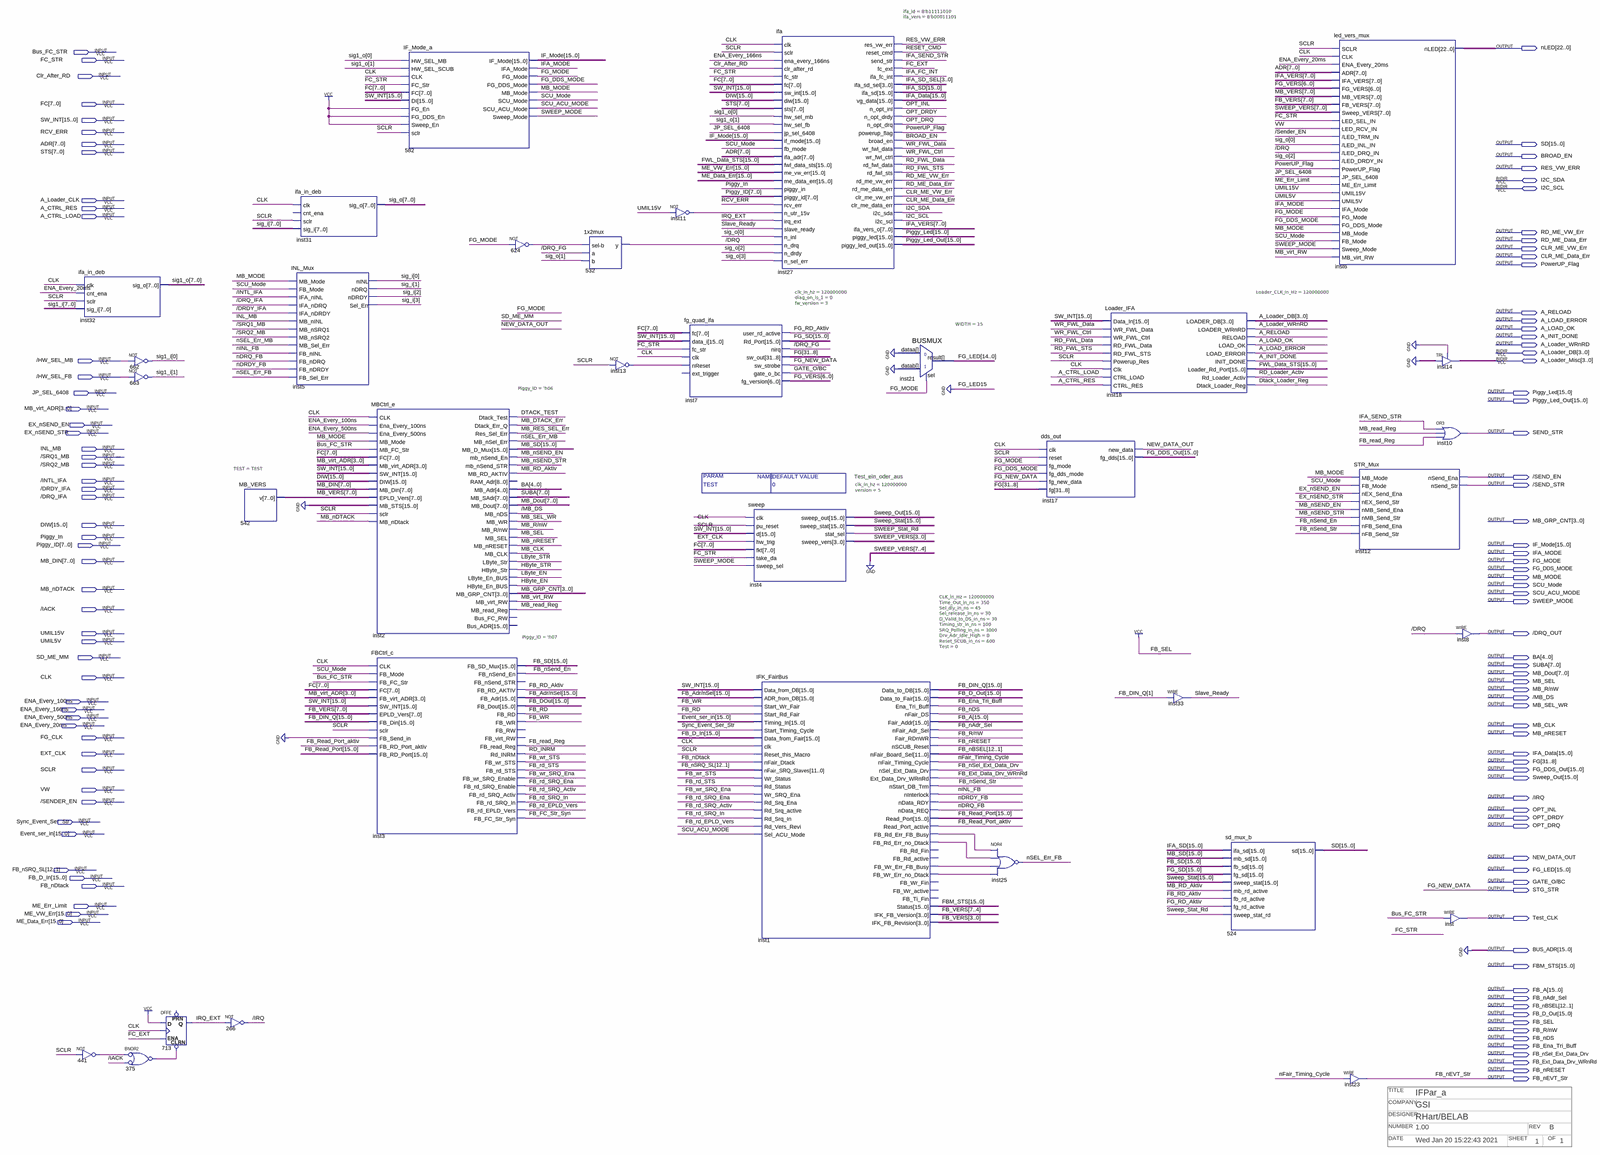
[diagram p0: schematic sheet, whole]
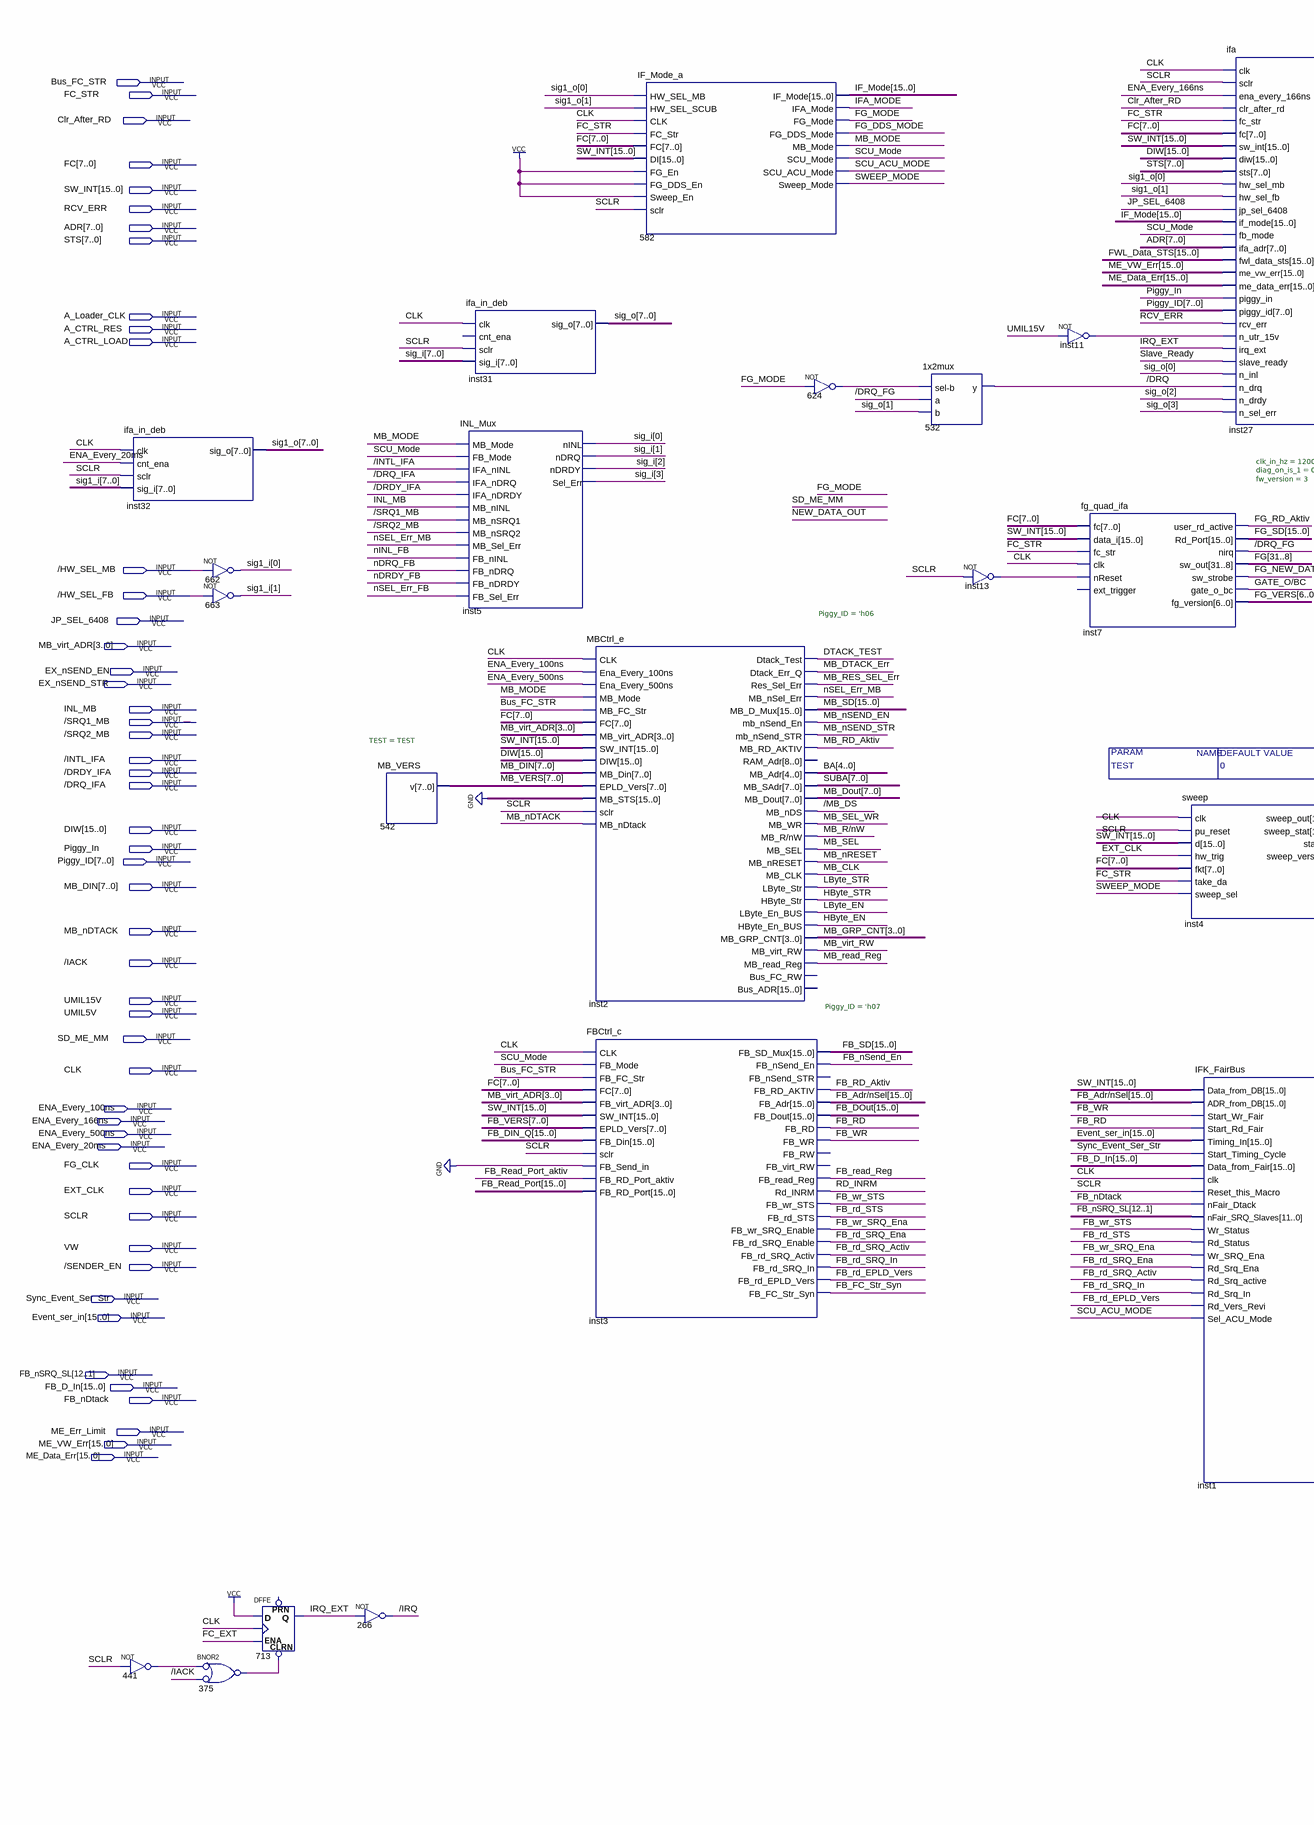
[diagram p1: schematic sheet, left part]
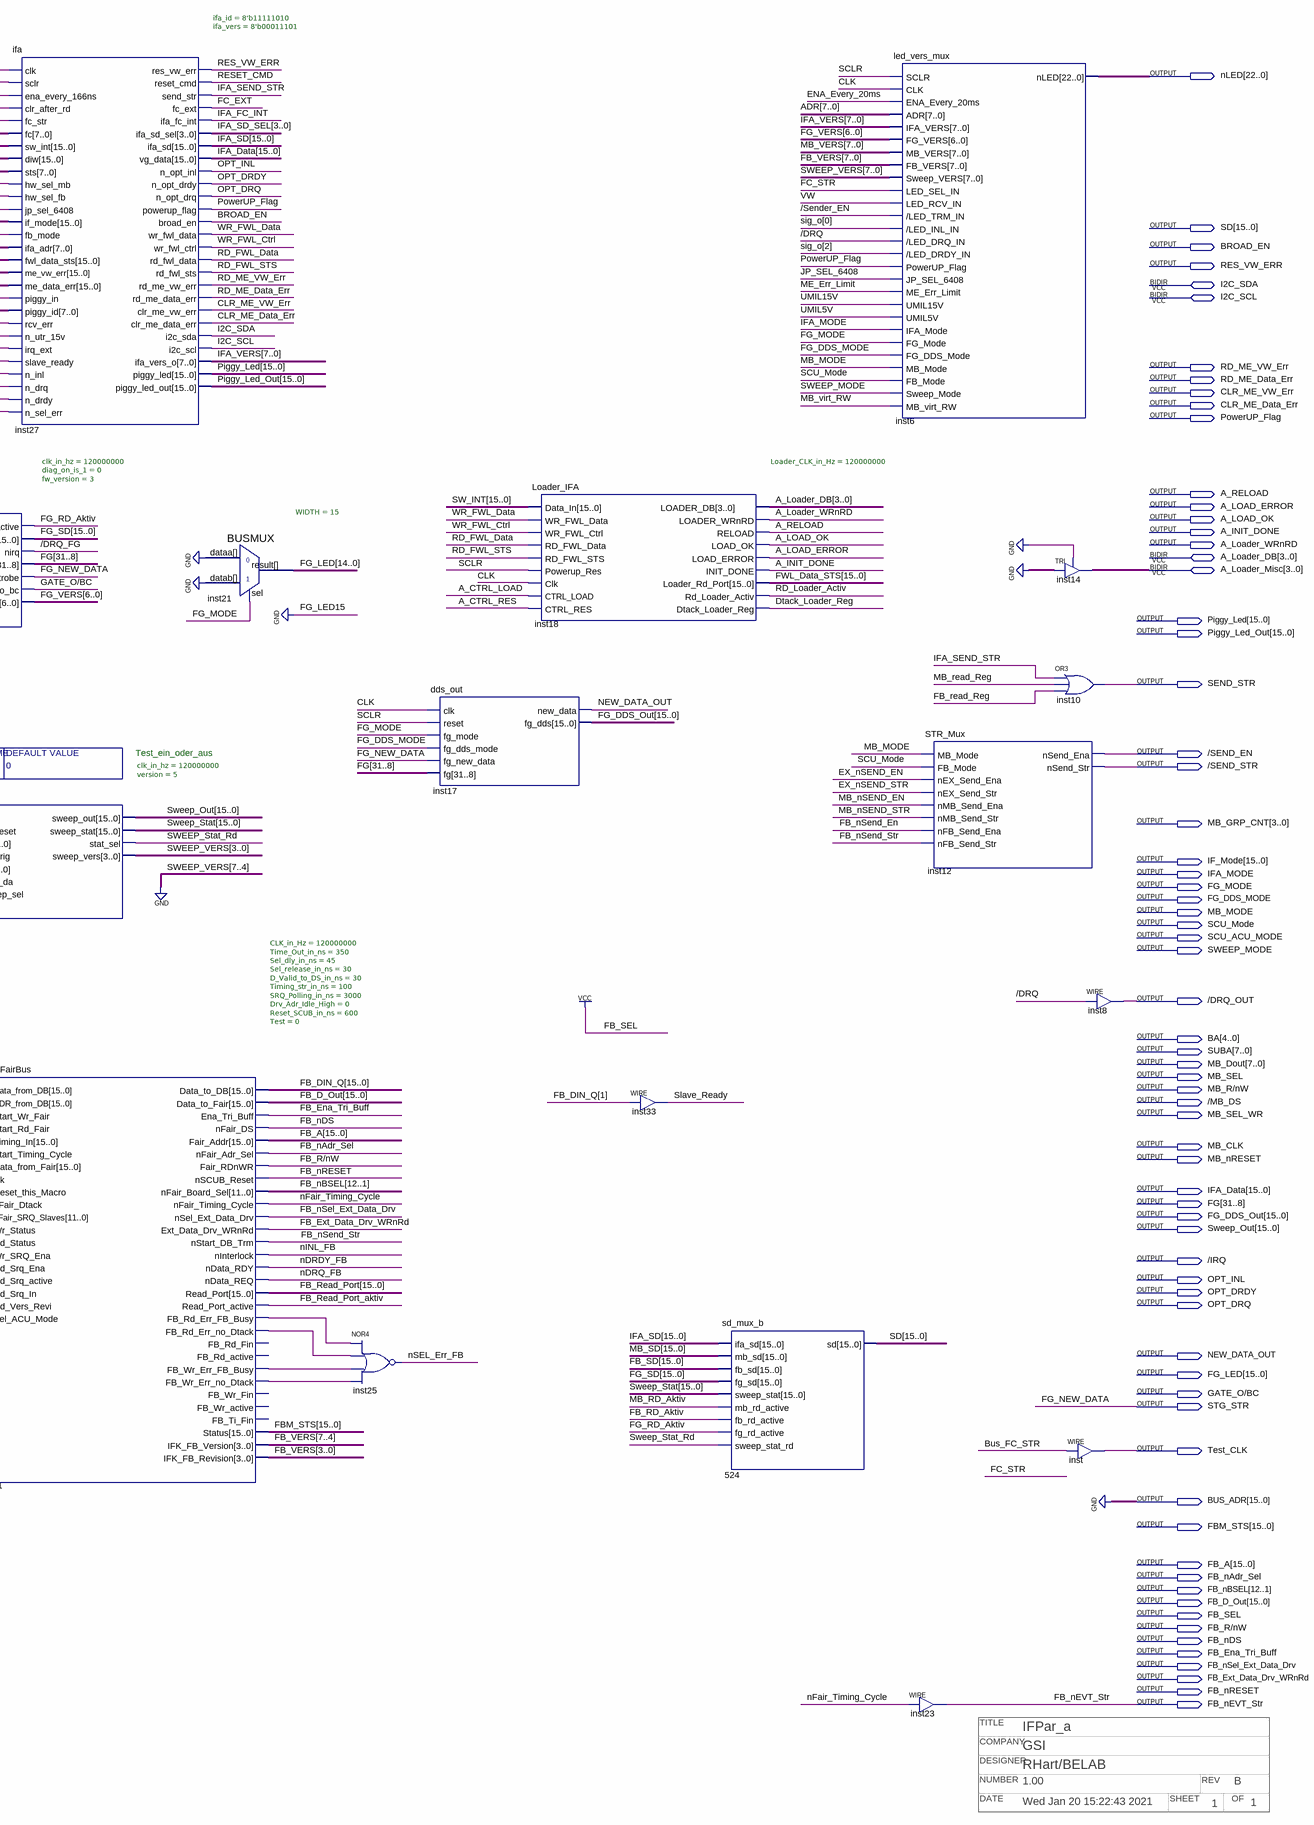
[diagram p2: schematic sheet, right part]
// Quartus schematic ifpar_a.bdf as structural Verilog: 34 symbols, 119 pins
// Title block: TITLE: IFPar_a; COMPANY: GSI; DESIGNER: RHart/BELAB; NUMBER: 1.00; REV: B; DATE: Wed Jan 20 15:22:43 2021; SHEET: 1; OF: 1
module ifpar_a #(parameter TEST = 0) (
  input  Bus_FC_STR,
  input  FC_STR,
  input  Clr_After_RD,
  input  [7:0] FC,
  input  [15:0] SW_INT,
  input  RCV_ERR,
  input  [7:0] ADR,
  input  [7:0] STS,
  input  A_Loader_CLK,
  input  A_CTRL_RES,
  input  A_CTRL_LOAD,
  input  \/HW_SEL_MB ,
  input  \/HW_SEL_FB ,
  input  JP_SEL_6408,
  input  [3:0] MB_virt_ADR,
  input  EX_nSEND_EN,
  input  EX_nSEND_STR,
  input  INL_MB,
  input  \/SRQ1_MB ,
  input  \/SRQ2_MB ,
  input  \/INTL_IFA ,
  input  \/DRDY_IFA ,
  input  \/DRQ_IFA ,
  input  [15:0] DIW,
  input  Piggy_In,
  input  [7:0] Piggy_ID,
  input  [7:0] MB_DIN,
  input  MB_nDTACK,
  input  \/IACK ,
  input  UMIL15V,
  input  UMIL5V,
  input  SD_ME_MM,
  input  CLK,
  input  ENA_Every_100ns,
  input  ENA_Every_166ns,
  input  ENA_Every_500ns,
  input  ENA_Every_20ms,
  input  FG_CLK,
  input  EXT_CLK,
  input  SCLR,
  input  VW,
  input  \/SENDER_EN ,
  input  Sync_Event_Ser_Str,
  input  [15:0] Event_ser_in,
  input  [12:1] FB_nSRQ_SL,
  input  [15:0] FB_D_In,
  input  FB_nDtack,
  input  ME_Err_Limit,
  input  [15:0] ME_VW_Err,
  input  [15:0] ME_Data_Err,
  inout  I2C_SDA,
  inout  I2C_SCL,
  inout  [3:0] A_Loader_DB,
  inout  [3:0] A_Loader_Misc,
  output [22:0] nLED,
  output [15:0] SD,
  output BROAD_EN,
  output RES_VW_ERR,
  output RD_ME_VW_Err,
  output RD_ME_Data_Err,
  output CLR_ME_VW_Err,
  output CLR_ME_Data_Err,
  output PowerUP_Flag,
  output A_RELOAD,
  output A_LOAD_ERROR,
  output A_LOAD_OK,
  output A_INIT_DONE,
  output A_Loader_WRnRD,
  output [15:0] Piggy_Led,
  output [15:0] Piggy_Led_Out,
  output SEND_STR,
  output \/SEND_EN ,
  output \/SEND_STR ,
  output [3:0] MB_GRP_CNT,
  output [15:0] IF_Mode,
  output IFA_MODE,
  output FG_MODE,
  output FG_DDS_MODE,
  output MB_MODE,
  output SCU_Mode,
  output SCU_ACU_MODE,
  output SWEEP_MODE,
  output \/DRQ_OUT ,
  output [4:0] BA,
  output [7:0] SUBA,
  output [7:0] MB_Dout,
  output MB_SEL,
  output \MB_R/nW ,
  output \/MB_DS ,
  output MB_SEL_WR,
  output MB_CLK,
  output MB_nRESET,
  output [15:0] IFA_Data,
  output [31:8] FG,
  output [15:0] FG_DDS_Out,
  output [15:0] Sweep_Out,
  output \/IRQ ,
  output OPT_INL,
  output OPT_DRDY,
  output OPT_DRQ,
  output NEW_DATA_OUT,
  output [15:0] FG_LED,
  output \GATE_O/BC ,
  output STG_STR,
  output Test_CLK,
  output [15:0] BUS_ADR,
  output [15:0] FBM_STS,
  output [15:0] FB_A,
  output FB_nAdr_Sel,
  output [12:1] FB_nBSEL,
  output [15:0] FB_D_Out,
  output FB_SEL,
  output \FB_R/nW ,
  output FB_nDS,
  output FB_Ena_Tri_Buff,
  output FB_nSel_Ext_Data_Drv,
  output FB_Ext_Data_Drv_WRnRd,
  output FB_nRESET,
  output FB_nEVT_Str
);

  wire \/DRQ , \/DRQ_FG , Dtack_Loader_Reg, DTACK_TEST, FB_FC_Str_Syn, FB_nSend_En, FB_nSend_Str, FB_RD,
       FB_RD_Aktiv, FB_rd_EPLD_Vers, FB_rd_SRQ_Activ, FB_rd_SRQ_Ena, FB_rd_SRQ_In, FB_rd_STS,
       FB_Read_Port_aktiv, FB_read_Reg, FB_WR, FB_wr_SRQ_Ena, FB_wr_STS, FC_EXT, FG_RD_Aktiv, HByte_EN,
       HByte_STR, IFA_FC_INT, IFA_SEND_STR, inst1_fb_rd_err_fb_busy, inst1_fb_rd_err_no_dtack,
       inst1_fb_wr_err_fb_busy, inst1_fb_wr_err_no_dtack, inst11_out, inst13_out, IRQ_EXT, LByte_EN,
       LByte_STR, MB_DTACK_Err, MB_nSEND_EN, MB_nSEND_STR, MB_RD_Aktiv, MB_read_Reg, MB_RES_SEL_Err,
       MB_virt_RW, n375_out, n441_out, n624_out, nDRDY_FB, nDRQ_FB, nFair_Timing_Cycle, nINL_FB, nSEL_Err_FB,
       nSEL_Err_MB, RD_FWL_Data, RD_FWL_STS, RD_INRM, RD_Loader_Activ, RESET_CMD, Slave_Ready, SWEEP_Stat_Rd,
       WR_FWL_Ctrl, WR_FWL_Data;
  wire [3:0] IFA_SD_SEL, SWEEP_VERS;
  wire [6:0] FG_VERS;
  wire [7:0] FB_VERS, IFA_VERS, MB_VERS, sig1_i, sig1_o, sig_i, sig_o;
  wire [15:0] \FB_Adr/nSel , FB_DIN_Q, FB_DOut, FB_Read_Port, FB_SD, FG_SD, FWL_Data_STS, IFA_SD, MB_SD,
       Sweep_Stat;

  ifa_in_deb inst32 (.clk(CLK), .cnt_ena(ENA_Every_20ms), .sclr(SCLR), .sig_i(sig1_i), .sig_o(sig1_o));
  not u_441 (n441_out, SCLR);
  not u_662 (sig1_i[0], \/HW_SEL_MB );
  not u_663 (sig1_i[1], \/HW_SEL_FB );
  nor u_375 (n375_out, ~n441_out, ~\/IACK );  // BNOR2
  DFFE u_713 (.CLRN(n375_out), .D(1'b1), .CLK(CLK), .ENA(FC_EXT), .Q(IRQ_EXT));  // open: PRN
  MB_VERS #(.TEST(TEST)) u_542 (.v(MB_VERS));
  not u_266 (\/IRQ , IRQ_EXT);
  ifa_in_deb inst31 (.clk(CLK), .sclr(SCLR), .sig_i(sig_i), .sig_o(sig_o));  // open: cnt_ena
  INL_Mux inst5 (
    .MB_Mode(MB_MODE), .FB_Mode(SCU_Mode), .IFA_nINL(\/INTL_IFA ), .IFA_nDRQ(\/DRQ_IFA ),
    .IFA_nDRDY(\/DRDY_IFA ), .MB_nINL(INL_MB), .MB_nSRQ1(\/SRQ1_MB ), .MB_nSRQ2(\/SRQ2_MB ),
    .MB_Sel_Err(nSEL_Err_MB), .FB_nINL(nINL_FB), .FB_nDRQ(nDRQ_FB), .FB_nDRDY(nDRDY_FB),
    .FB_Sel_Err(nSEL_Err_FB), .nINL(sig_i[0]), .nDRQ(sig_i[1]), .nDRDY(sig_i[2]), .Sel_Err(sig_i[3]));
  MBCtrl_e #(.Piggy_ID('h06)) inst2 (
    .CLK(CLK), .Ena_Every_100ns(ENA_Every_100ns), .Ena_Every_500ns(ENA_Every_500ns), .MB_Mode(MB_MODE),
    .MB_FC_Str(Bus_FC_STR), .FC(FC), .MB_virt_ADR(MB_virt_ADR), .SW_INT(SW_INT), .DIW(DIW), .MB_Din(MB_DIN),
    .EPLD_Vers(MB_VERS), .MB_STS({16{1'b0}}), .sclr(SCLR), .MB_nDtack(MB_nDTACK), .Dtack_Test(DTACK_TEST),
    .Dtack_Err_Q(MB_DTACK_Err), .Res_Sel_Err(MB_RES_SEL_Err), .MB_nSel_Err(nSEL_Err_MB), .MB_D_Mux(MB_SD),
    .mb_nSend_En(MB_nSEND_EN), .mb_nSend_STR(MB_nSEND_STR), .MB_RD_AKTIV(MB_RD_Aktiv), .MB_Adr(BA),
    .MB_SAdr(SUBA), .MB_Dout(MB_Dout), .MB_nDS(\/MB_DS ), .MB_WR(MB_SEL_WR), .\MB_R/nW (\MB_R/nW ),
    .MB_SEL(MB_SEL), .MB_nRESET(MB_nRESET), .MB_CLK(MB_CLK), .LByte_Str(LByte_STR), .HByte_Str(HByte_STR),
    .LByte_En_BUS(LByte_EN), .HByte_En_BUS(HByte_EN), .MB_GRP_CNT(MB_GRP_CNT), .MB_virt_RW(MB_virt_RW),
    .MB_read_Reg(MB_read_Reg));  // open: RAM_Adr, Bus_FC_RW, Bus_ADR
  FBCtrl_c #(.Piggy_ID('h07)) inst3 (
    .CLK(CLK), .FB_Mode(SCU_Mode), .FB_FC_Str(Bus_FC_STR), .FC(FC), .FB_virt_ADR(MB_virt_ADR),
    .SW_INT(SW_INT), .EPLD_Vers(FB_VERS), .FB_Din(FB_DIN_Q), .sclr(SCLR), .FB_Send_in(1'b0),
    .FB_RD_Port_aktiv(FB_Read_Port_aktiv), .FB_RD_Port(FB_Read_Port), .FB_SD_Mux(FB_SD),
    .FB_nSend_En(FB_nSend_En), .FB_RD_AKTIV(FB_RD_Aktiv), .FB_Adr(\FB_Adr/nSel ), .FB_Dout(FB_DOut),
    .FB_RD(FB_RD), .FB_WR(FB_WR), .FB_read_Reg(FB_read_Reg), .Rd_INRM(RD_INRM), .FB_wr_STS(FB_wr_STS),
    .FB_rd_STS(FB_rd_STS), .FB_wr_SRQ_Enable(FB_wr_SRQ_Ena), .FB_rd_SRQ_Enable(FB_rd_SRQ_Ena),
    .FB_rd_SRQ_Activ(FB_rd_SRQ_Activ), .FB_rd_SRQ_In(FB_rd_SRQ_In), .FB_rd_EPLD_Vers(FB_rd_EPLD_Vers),
    .FB_FC_Str_Syn(FB_FC_Str_Syn));  // open: FB_nSend_STR, FB_RW, FB_virt_RW
  IF_Mode_a u_582 (
    .HW_SEL_MB(sig1_o[0]), .HW_SEL_SCUB(sig1_o[1]), .CLK(CLK), .FC_Str(FC_STR), .FC(FC), .DI(SW_INT),
    .FG_En(1'b1), .FG_DDS_En(1'b1), .Sweep_En(1'b1), .sclr(SCLR), .IF_Mode(IF_Mode), .IFA_Mode(IFA_MODE),
    .FG_Mode(FG_MODE), .FG_DDS_Mode(FG_DDS_MODE), .MB_Mode(MB_MODE), .SCU_Mode(SCU_Mode),
    .SCU_ACU_Mode(SCU_ACU_MODE), .Sweep_Mode(SWEEP_MODE));
  not u_624 (n624_out, FG_MODE);
  \1x2mux  u_532 (.\sel-b (n624_out), .a(\/DRQ_FG ), .b(sig_o[1]), .y(\/DRQ ));
  not inst13 (inst13_out, SCLR);
  not inst11 (inst11_out, UMIL15V);
  fg_quad_ifa #(.clk_in_hz(120000000), .diag_on_is_1(0), .fw_version(3)) inst7 (
    .fc(FC), .data_i(SW_INT), .fc_str(FC_STR), .clk(CLK), .nReset(inst13_out), .user_rd_active(FG_RD_Aktiv),
    .Rd_Port(FG_SD), .nirq(\/DRQ_FG ), .sw_out(FG), .sw_strobe(STG_STR), .gate_o_bc(\GATE_O/BC ),
    .fg_version(FG_VERS));  // open: ext_trigger
  sweep #(.clk_in_hz(120000000), .version(5)) inst4 (
    .clk(CLK), .pu_reset(SCLR), .d(SW_INT), .hw_trig(EXT_CLK), .fkt(FC), .take_da(FC_STR),
    .sweep_sel(SWEEP_MODE), .sweep_out(Sweep_Out), .sweep_stat(Sweep_Stat), .stat_sel(SWEEP_Stat_Rd),
    .sweep_vers(SWEEP_VERS));
  IFK_FairBus #(.CLK_in_Hz(120000000), .Time_Out_in_ns(350), .Sel_dly_in_ns(45), .Sel_release_in_ns(30), .D_Valid_to_DS_in_ns(30), .Timing_str_in_ns(100), .SRQ_Polling_in_ns(3000), .Drv_Adr_Idle_High(0), .Reset_SCUB_in_ns(600), .Test(0)) inst1 (
    .Data_from_DB(SW_INT), .ADR_from_DB(\FB_Adr/nSel ), .Start_Wr_Fair(FB_WR), .Start_Rd_Fair(FB_RD),
    .Timing_In(Event_ser_in), .Start_Timing_Cycle(Sync_Event_Ser_Str), .Data_from_Fair(FB_D_In), .clk(CLK),
    .Reset_this_Macro(SCLR), .nFair_Dtack(FB_nDtack), .nFair_SRQ_Slaves(FB_nSRQ_SL), .Wr_Status(FB_wr_STS),
    .Rd_Status(FB_rd_STS), .Wr_SRQ_Ena(FB_wr_SRQ_Ena), .Rd_Srq_Ena(FB_rd_SRQ_Ena),
    .Rd_Srq_active(FB_rd_SRQ_Activ), .Rd_Srq_In(FB_rd_SRQ_In), .Rd_Vers_Revi(FB_rd_EPLD_Vers),
    .Sel_ACU_Mode(SCU_ACU_MODE), .Data_to_DB(FB_DIN_Q), .Data_to_Fair(FB_D_Out),
    .Ena_Tri_Buff(FB_Ena_Tri_Buff), .nFair_DS(FB_nDS), .Fair_Addr(FB_A), .nFair_Adr_Sel(FB_nAdr_Sel),
    .Fair_RDnWR(\FB_R/nW ), .nSCUB_Reset(FB_nRESET), .nFair_Board_Sel(FB_nBSEL),
    .nFair_Timing_Cycle(nFair_Timing_Cycle), .nSel_Ext_Data_Drv(FB_nSel_Ext_Data_Drv),
    .Ext_Data_Drv_WRnRd(FB_Ext_Data_Drv_WRnRd), .nStart_DB_Trm(FB_nSend_Str), .nInterlock(nINL_FB),
    .nData_RDY(nDRDY_FB), .nData_REQ(nDRQ_FB), .Read_Port(FB_Read_Port),
    .Read_Port_active(FB_Read_Port_aktiv), .FB_Rd_Err_FB_Busy(inst1_fb_rd_err_fb_busy),
    .FB_Rd_Err_no_Dtack(inst1_fb_rd_err_no_dtack), .FB_Wr_Err_FB_Busy(inst1_fb_wr_err_fb_busy),
    .FB_Wr_Err_no_Dtack(inst1_fb_wr_err_no_dtack), .Status(FBM_STS), .IFK_FB_Version(FB_VERS[7:4]),
    .IFK_FB_Revision(FB_VERS[3:0]));  // open: FB_Rd_Fin, FB_Rd_active, FB_Wr_Fin, FB_Wr_active, FB_Ti_Fin
  ifa #(.ifa_id(8'b11111010), .ifa_vers(8'b00011101)) inst27 (
    .clk(CLK), .sclr(SCLR), .ena_every_166ns(ENA_Every_166ns), .clr_after_rd(Clr_After_RD), .fc_str(FC_STR),
    .fc(FC), .sw_int(SW_INT), .diw(DIW), .sts(STS), .hw_sel_mb(sig1_o[0]), .hw_sel_fb(sig1_o[1]),
    .jp_sel_6408(JP_SEL_6408), .if_mode(IF_Mode), .fb_mode(SCU_Mode), .ifa_adr(ADR),
    .fwl_data_sts(FWL_Data_STS), .me_vw_err(ME_VW_Err), .me_data_err(ME_Data_Err), .piggy_in(Piggy_In),
    .piggy_id(Piggy_ID), .rcv_err(RCV_ERR), .n_utr_15v(inst11_out), .irq_ext(IRQ_EXT),
    .slave_ready(Slave_Ready), .n_inl(sig_o[0]), .n_drq(\/DRQ ), .n_drdy(sig_o[2]), .n_sel_err(sig_o[3]),
    .res_vw_err(RES_VW_ERR), .reset_cmd(RESET_CMD), .send_str(IFA_SEND_STR), .fc_ext(FC_EXT),
    .ifa_fc_int(IFA_FC_INT), .ifa_sd_sel(IFA_SD_SEL), .ifa_sd(IFA_SD), .vg_data(IFA_Data),
    .n_opt_inl(OPT_INL), .n_opt_drdy(OPT_DRDY), .n_opt_drq(OPT_DRQ), .powerup_flag(PowerUP_Flag),
    .broad_en(BROAD_EN), .wr_fwl_data(WR_FWL_Data), .wr_fwl_ctrl(WR_FWL_Ctrl), .rd_fwl_data(RD_FWL_Data),
    .rd_fwl_sts(RD_FWL_STS), .rd_me_vw_err(RD_ME_VW_Err), .rd_me_data_err(RD_ME_Data_Err),
    .clr_me_vw_err(CLR_ME_VW_Err), .clr_me_data_err(CLR_ME_Data_Err), .ifa_vers_o(IFA_VERS),
    .piggy_led(Piggy_Led), .piggy_led_out(Piggy_Led_Out), .i2c_sda(I2C_SDA), .i2c_scl(I2C_SCL));
  BUSMUX #(.WIDTH(15)) inst21 (.datab({15{1'b0}}), .sel(FG_MODE), .dataa({15{1'b0}}), .result(FG_LED[14:0]));
  nor inst25 (nSEL_Err_FB, inst1_fb_rd_err_fb_busy, inst1_fb_rd_err_no_dtack, inst1_fb_wr_err_fb_busy, inst1_fb_wr_err_no_dtack);
  dds_out inst17 (
    .clk(CLK), .reset(SCLR), .fg_mode(FG_MODE), .fg_dds_mode(FG_DDS_MODE), .fg_new_data(STG_STR), .fg(FG),
    .new_data(NEW_DATA_OUT), .fg_dds(FG_DDS_Out));
  Loader_IFA #(.Loader_CLK_in_Hz(120000000)) inst18 (
    .Data_In(SW_INT), .WR_FWL_Data(WR_FWL_Data), .WR_FWL_Ctrl(WR_FWL_Ctrl), .RD_FWL_Data(RD_FWL_Data),
    .RD_FWL_STS(RD_FWL_STS), .Powerup_Res(SCLR), .Clk(CLK), .CTRL_LOAD(A_CTRL_LOAD), .CTRL_RES(A_CTRL_RES),
    .LOADER_WRnRD(A_Loader_WRnRD), .RELOAD(A_RELOAD), .LOAD_OK(A_LOAD_OK), .LOAD_ERROR(A_LOAD_ERROR),
    .INIT_DONE(A_INIT_DONE), .Loader_Rd_Port(FWL_Data_STS), .Rd_Loader_Activ(RD_Loader_Activ),
    .Dtack_Loader_Reg(Dtack_Loader_Reg), .LOADER_DB(A_Loader_DB));
  assign Slave_Ready = FB_DIN_Q[1];  // WIRE inst33
  sd_mux_b u_524 (
    .ifa_sd(IFA_SD), .mb_sd(MB_SD), .fb_sd(FB_SD), .fg_sd(FG_SD), .sweep_stat(Sweep_Stat),
    .mb_rd_active(MB_RD_Aktiv), .fb_rd_active(FB_RD_Aktiv), .fg_rd_active(FG_RD_Aktiv),
    .sweep_stat_rd(SWEEP_Stat_Rd), .sd(SD));
  led_vers_mux inst6 (
    .SCLR(SCLR), .CLK(CLK), .ENA_Every_20ms(ENA_Every_20ms), .ADR(ADR), .IFA_VERS(IFA_VERS),
    .FG_VERS(FG_VERS), .MB_VERS(MB_VERS), .FB_VERS(FB_VERS), .Sweep_VERS({4'b0000, SWEEP_VERS}),
    .LED_SEL_IN(FC_STR), .LED_RCV_IN(VW), .\/LED_TRM_IN (\/SENDER_EN ), .\/LED_INL_IN (sig_o[0]),
    .\/LED_DRQ_IN (\/DRQ ), .\/LED_DRDY_IN (sig_o[2]), .PowerUP_Flag(PowerUP_Flag),
    .JP_SEL_6408(JP_SEL_6408), .ME_Err_Limit(ME_Err_Limit), .UMIL15V(UMIL15V), .UMIL5V(UMIL5V),
    .IFA_Mode(IFA_MODE), .FG_Mode(FG_MODE), .FG_DDS_Mode(FG_DDS_MODE), .MB_Mode(MB_MODE), .FB_Mode(SCU_Mode),
    .Sweep_Mode(SWEEP_MODE), .MB_virt_RW(MB_virt_RW), .nLED(nLED));
  STR_Mux inst12 (
    .MB_Mode(MB_MODE), .FB_Mode(SCU_Mode), .nEX_Send_Ena(EX_nSEND_EN), .nEX_Send_Str(EX_nSEND_STR),
    .nMB_Send_Ena(MB_nSEND_EN), .nMB_Send_Str(MB_nSEND_STR), .nFB_Send_Ena(FB_nSend_En),
    .nFB_Send_Str(FB_nSend_Str), .nSend_Ena(\/SEND_EN ), .nSend_Str(\/SEND_STR ));
  assign FB_nEVT_Str = nFair_Timing_Cycle;  // WIRE inst23
  TRI inst14[3:0] (.IN(4'b0000), .OE(1'b0), .OUT(A_Loader_Misc));
  or inst10 (SEND_STR, IFA_SEND_STR, MB_read_Reg, FB_read_Reg);
  assign \/DRQ_OUT  = \/DRQ ;  // WIRE inst8
  assign Test_CLK = Bus_FC_STR;  // WIRE inst

  assign BUS_ADR = {16{1'b0}};
  assign FB_SEL = 1'b1;
  assign FG_LED[15] = 1'b0;

  // Other names for the same wires on the sheet: FG_NEW_DATA = STG_STR

  // Notes on the sheet:
  //   Test_ein_oder_aus
endmodule
